# Altium schematic sheet Processor.SchDoc
size A3
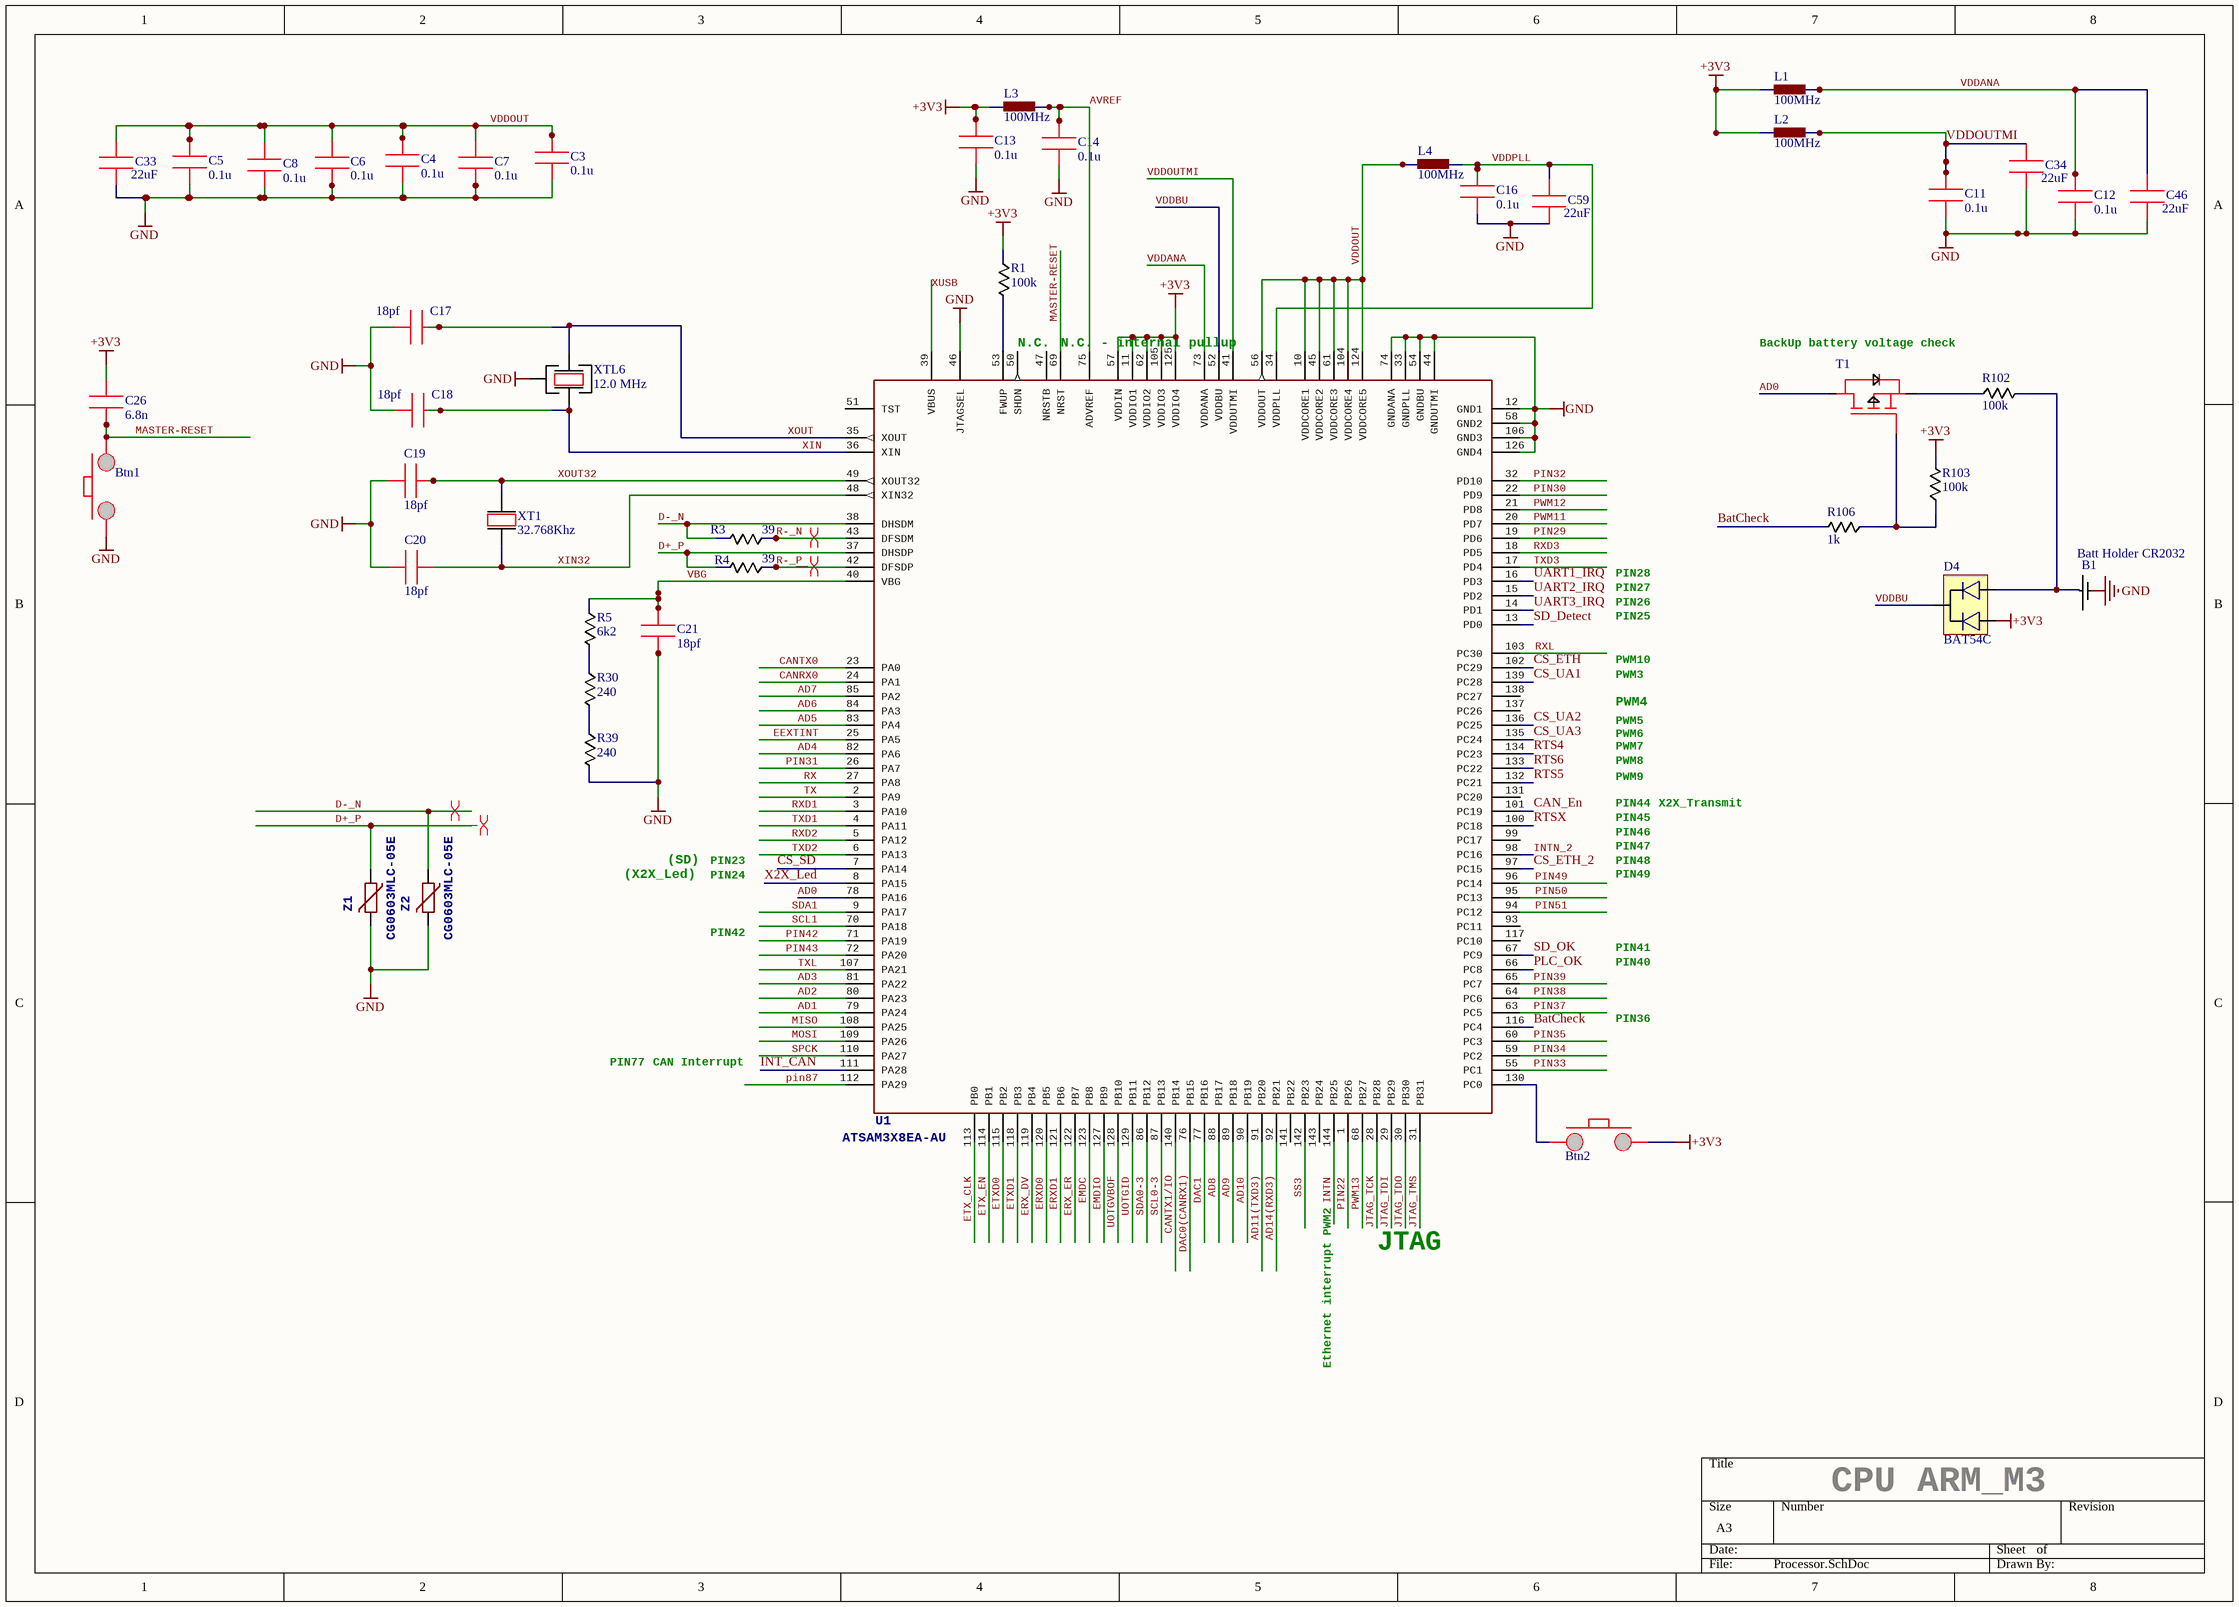
[diagram p0: Processor.SchDoc]

## Parts
B1  Batt Holder CR2032  [Batt Holder CR2032]
Btn1  Tact Switch  [Tact Switch]  (value not drawn)
Btn2  Tact Switch  [Tact Switch]  (value not drawn)
C3  0.1u  [0603 CAP]
C4  0.1u  [0603 CAP]
C5  0.1u  [0603 CAP]
C6  0.1u  [0603 CAP]
C7  0.1u  [0603 CAP]
C8  0.1u  [0603 CAP]
C11  0.1u  [0603 CAP]
C12  0.1u  [0603 CAP]
C13  0.1u  [0603 CAP]
C14  0.1u  [0603 CAP]
C16  0.1u  [0603 CAP]
C17  18pf  [0603 CAP]
C18  18pf  [0603 CAP]
C19  18pf  [0603 CAP]
C20  18pf  [0603 CAP]
C21  18pf  [0603 CAP]
C26  6.8n  [0603 CAP]
C33  22uF  [CAP CER 1210 NP]
C34  22uF  [CAP CER 1210 NP]
C46  22uF  [CAP CER 1210 NP]
C59  22uF  [CAP CER 1210 NP]
D4  BAT54C  [SOT23]
L1  100MHz  [0805]
L2  100MHz  [0805]
L3  100MHz  [0805]
L4  100MHz  [0805]
R1  100k  [0603 - RES]
R3  39  [0603 - RES]
R4  39  [0603 - RES]
R5  6k2  [0603 - RES]
R30  240  [0603 - RES]
R39  240  [0603 - RES]
R102  100k  [0603 - RES]
R103  100k  [0603 - RES]
R106  1k  [0603 - RES]
T1  IRLML6302  [SOT23]  (value not drawn)
U1  ATSAM3X8EA-AU  [LQFP144]
XT1  32.768Khz  [XTAL KX-327T]
XTL6  12.0 MHz  [XTAL KX-7T]
Z1  CG0603MLC-05E  [0603 - RES]
Z2  CG0603MLC-05E  [0603 - RES]

## Nets
+3V3: Btn2.1 C13.2 C26.2 D4.1 L1.1 L2.1 L3.1 R1.1 R103.2 U1.11(VDDIO1) U1.57(VDDIN) U1.62(VDDIO2) U1.105(VDDIO3) U1.125(VDDIO4)
GND: B1.0 Btn1.0 C3.1 C4.1 C5.1 C6.1 C7.1 C8.1 C11.1 C12.1 C13.1 C14.1 C16.1 C17.1 C18.1 C19.2 C20.2 C21.1 C33.1 C34.1 C46.1 C59.1 R39.2 U1.12(GND1) U1.33(GNDPLL) U1.44(GNDUTMI) U1.46(JTAGSEL) U1.54(GNDBU) U1.58(GND2) U1.74(GNDANA) U1.106(GND3) U1.126(GND4) XTL6.2 Z1.2 Z2.2
AD0: T1.3 U1.78(PA16)
AD1: U1.79(PA24)
AD2: U1.80(PA23)
AD3: U1.81(PA22)
AD4: U1.82(PA6)
AD5: U1.83(PA4)
AD6: U1.84(PA3)
AD7: U1.85(PA2)
AD8: U1.88(PB17)
AD9: U1.89(PB18)
AD10: U1.90(PB19)
AD11(TXD3): U1.91(PB20)
AD14(RXD3): U1.92(PB21)
AVREF: C14.2 L3.2 U1.75(ADVREF)
BatCheck: R106.2 U1.116(PC4)
CAN_En: U1.101(PC19)
CANRX0: U1.24(PA1)
CANTX0: U1.23(PA0)
CANTX1/IO: U1.140(PB14)
CS_ETH: U1.102(PC29)
CS_ETH_2: U1.97(PC15)
CS_SD: U1.7(PA14)
CS_UA1: U1.139(PC28)
CS_UA2: U1.136(PC25)
CS_UA3: U1.135(PC24)
D+_P: R4.2 U1.37(DHSDP) Z1.1
D-_N: R3.2 U1.38(DHSDM) Z2.1
DAC0(CANRX1): U1.76(PB15)
DAC1: U1.77(PB16)
EEXTINT: U1.25(PA5)
EMDC: U1.123(PB8)
EMDIO: U1.127(PB9)
ERX_DV: U1.119(PB4)
ERX_ER: U1.122(PB7)
ERXD0: U1.120(PB5)
ERXD1: U1.121(PB6)
ETX_CLK: U1.113(PB0)
ETX_EN: U1.114(PB1)
ETXD0: U1.115(PB2)
ETXD1: U1.118(PB3)
INT_CAN: U1.111(PA28)
INTN: U1.144(PB25)
INTN_2: U1.98(PC16)
JTAG_TCK: U1.28(PB28)
JTAG_TDI: U1.29(PB29)
JTAG_TDO: U1.30(PB30)
JTAG_TMS: U1.31(PB31)
MASTER-RESET: Btn1.1 C26.1 U1.69(NRST)
MISO: U1.108(PA25)
MOSI: U1.109(PA26)
PIN22: U1.1(PB26)
PIN29: U1.19(PD6)
PIN30: U1.22(PD9)
PIN31: U1.26(PA7)
PIN32: U1.32(PD10)
PIN33: U1.55(PC1)
PIN34: U1.59(PC2)
PIN35: U1.60(PC3)
PIN37: U1.63(PC5)
PIN38: U1.64(PC6)
PIN39: U1.65(PC7)
PIN42: U1.71(PA19)
PIN43: U1.72(PA20)
PIN49: U1.96(PC14)
PIN50: U1.95(PC13)
PIN51: U1.94(PC12)
pin87: U1.112(PA29)
PLC_OK: U1.66(PC8)
PWM11: U1.20(PD7)
PWM12: U1.21(PD8)
PWM13: U1.68(PB27)
R-_N: R3.1 U1.43(DFSDM)
R-_P: R4.1 U1.42(DFSDP)
RTS4: U1.134(PC23)
RTS5: U1.132(PC21)
RTS6: U1.133(PC22)
RTSX: U1.100(PC18)
RX: U1.27(PA8)
RXD1: U1.3(PA10)
RXD2: U1.5(PA12)
RXD3: U1.18(PD5)
RXL: U1.103(PC30)
SCL0-3: U1.87(PB13)
SCL1: U1.70(PA18)
SD_Detect: U1.13(PD0)
SD_OK: U1.67(PC9)
SDA0-3: U1.86(PB12)
SDA1: U1.9(PA17)
SPCK: U1.110(PA27)
SS3: U1.142(PB23)
TX: U1.2(PA9)
TXD1: U1.4(PA11)
TXD2: U1.6(PA13)
TXD3: U1.17(PD4)
TXL: U1.107(PA21)
UART1_IRQ: U1.16(PD3)
UART2_IRQ: U1.15(PD2)
UART3_IRQ: U1.14(PD1)
UOTGID: U1.129(PB11)
UOTGVBOF: U1.128(PB10)
VBG: C21.2 R5.1 U1.40(VBG)
VDDANA: C12.2 C46.2 L1.2 U1.73(VDDANA)
VDDBU: D4.3 U1.52(VDDBU)
VDDOUT: C3.2 C4.2 C5.2 C6.2 C7.2 C8.2 C33.2 L4.1 U1.10(VDDCORE1) U1.45(VDDCORE2) U1.56(VDDOUT) U1.61(VDDCORE3) U1.104(VDDCORE4) U1.124(VDDCORE5)
VDDOUTMI: C11.2 C34.2 L2.2 U1.41(VDDUTMI)
VDDPLL: C16.2 C59.2 L4.2 U1.34(VDDPLL)
X2X_Led: U1.8(PA15)
XIN: C18.2 U1.36(XIN) XTL6.3
XIN32: C20.1 U1.48(XIN32) XT1.1
XOUT: C17.2 U1.35(XOUT) XTL6.1
XOUT32: C19.1 U1.49(XOUT32) XT1.2
XUSB: U1.39(VBUS)
NetB1_1: B1.1 D4.2 R102.2
NetBtn2_0: Btn2.0 U1.130(PC0)
NetR1_2: R1.2 U1.53(FWUP)
NetR5_2: R5.2 R30.1
NetR30_2: R30.2 R39.1
NetR102_1: R102.1 T1.2
NetR103_1: R103.1 R106.1 T1.1

Not connected (* = marked no-connect by the designer): U1 47(NRSTB) 50(SHDN) 51(TST) 93(PC11) 99(PC17) 117(PC10) 131(PC20) 137(PC26) 138(PC27) 141(PB22) 143(PB24)

## Layout directives
differential pair: (no net found under the mark)

## Notes on the sheet
- N.C.
- (near U1) N.C. - internal pullup
- (near T1) BackUp battery voltage check
- PIN28
- PIN27
- PIN26
- PIN25
- PWM3
- PWM10
- PWM5
- PWM6
- PWM7
- PWM8
- PWM4
- PWM9
- PIN44
- PIN46
- PIN45
- X2X_Transmit
- (X2X_Led)
- (SD)
- PIN23
- PIN24
- PIN47
- PIN48
- PIN49
- PIN42
- PIN41
- PIN40
- PIN36
- PIN77
- CAN Interrupt
- PWM2
- JTAG
- Ethernet interrupt
- CPU ARM_M3

## Library data of the parts
B1 = Batt Holder CR2032: 1734178-1
Btn1 Btn2 = Tact Switch: KLS7-TS6606-4.3-180
C3-C8 C11-C14 C16 = Capasitor 0805
C17-C21 = Capasitor 0805: GRM1885C1H180JA01D
C26 = 0603 CAP: CC0603KRX7R9BB682
C33 C34 C46 C59 = 0805 Cap: CC1210KKX5R7BB226
L1-L4 = BLM21PG220SN1D
R1 R102 R103 = Resistor 0805: RC0603FR-07100KL
R3-R5 R30 R39 = Resistor 0805: 0805 SMD Resistor
R106 = Resistor 0805: RC0603FR-078K2
U1 = ATSAM3X/AAU
XT1 = KX – 327XS
XTL6 = KX-7: Geyer KX-7 12.0 MHz
Z1 Z2 = VARISTORCN0603: <b>VARISTOR</b>